# Altium schematic sheet isoJTAG-Isolation.SchDoc
size A4; Organization: UltraZohm
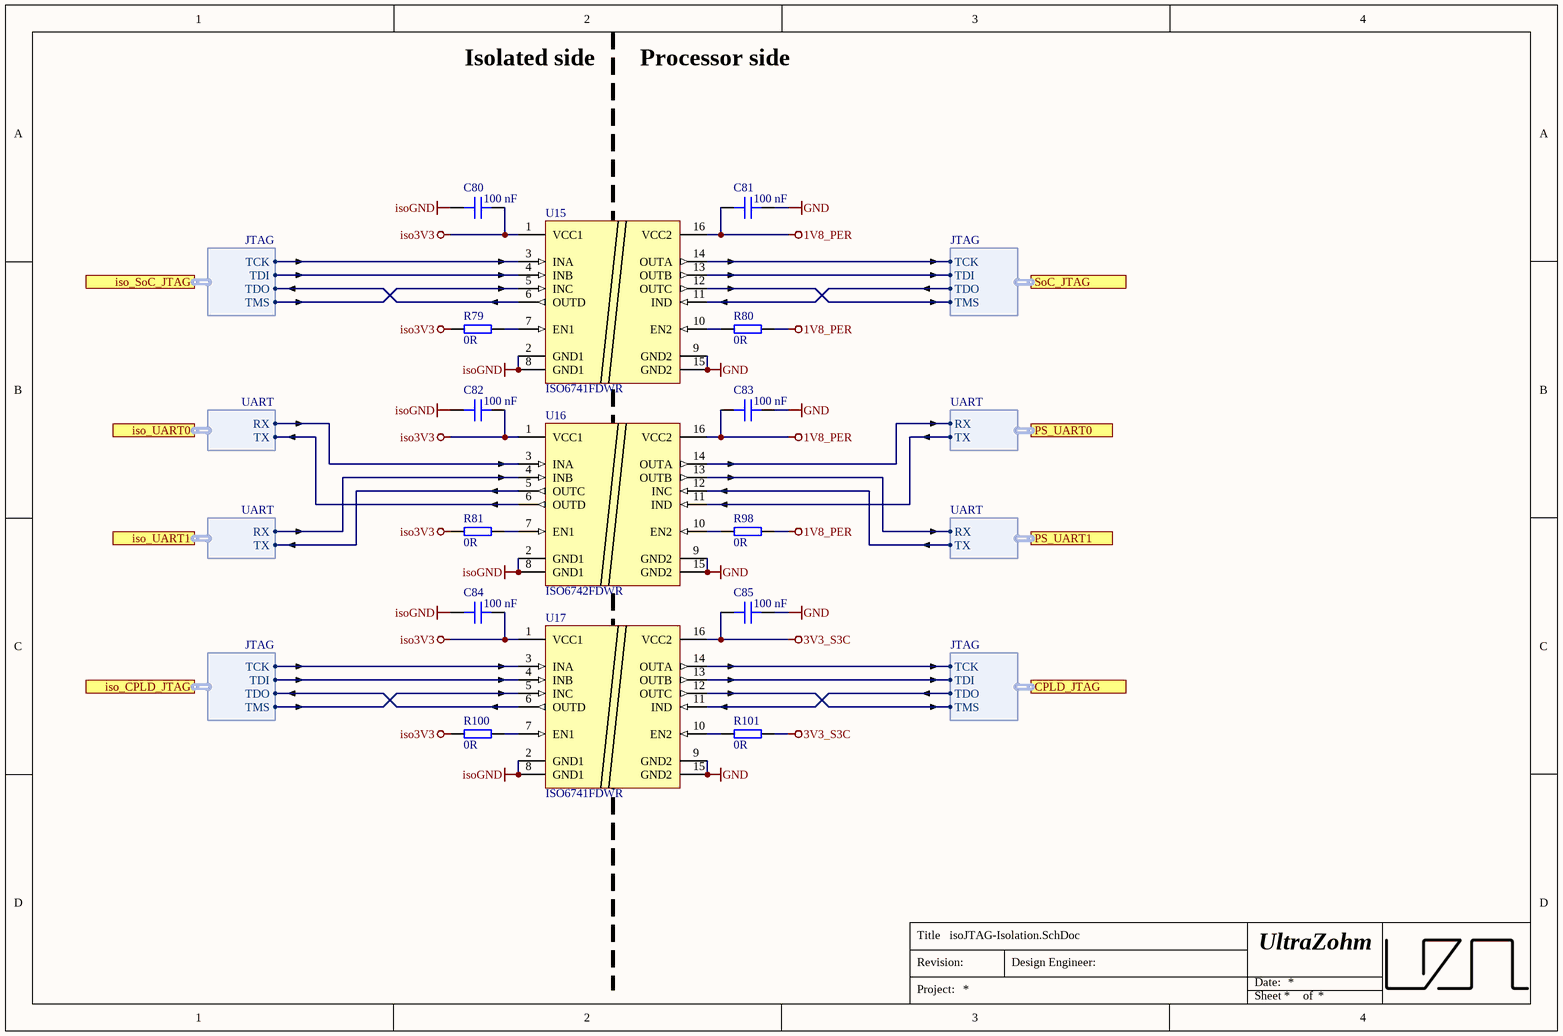
[diagram p0: isoJTAG-Isolation.SchDoc]

## Parts
C80  100 nF  [C_0402_TE]
C81  100 nF  [C_0402_TE]
C82  100 nF  [C_0402_TE]
C83  100 nF  [C_0402_TE]
C84  100 nF  [C_0402_TE]
C85  100 nF  [C_0402_TE]
R79  0R  [R_0402_TE]
R80  0R  [R_0402_TE]
R81  0R  [R_0402_TE]
R98  0R  [R_0402_TE]
R100  0R  [R_0402_TE]
R101  0R  [R_0402_TE]
U15  ISO6741FDWR  [SOIC127P1030X265-16N]
U16  ISO6742FDWR  [SOIC127P1030X265-16N]
U17  ISO6741FDWR  [SOIC127P1030X265-16N]

## Ports
CPLD_JTAG (harness JTAG), iso_CPLD_JTAG (harness JTAG), iso_SoC_JTAG (harness JTAG), iso_UART0 (harness UART), iso_UART1 (harness UART), PS_UART0 (harness UART), PS_UART1 (harness UART), SoC_JTAG (harness JTAG)

## Harnesses
JTAG: TCK, TDI, TDO, TMS
UART: RX, TX

## Nets
1V8_PER: C81.2 C83.2 R80.2 R98.2 U15.16(VCC2) U16.16(VCC2)
3V3_S3C: C85.2 R101.2 U17.16(VCC2)
GND: C81.1 C83.1 C85.1 U15.9(GND2) U15.15(GND2) U16.9(GND2) U16.15(GND2) U17.9(GND2) U17.15(GND2)
iso3V3: C80.1 C82.1 C84.1 R79.1 R81.1 R100.1 U15.1(VCC1) U16.1(VCC1) U17.1(VCC1)
isoGND: C80.2 C82.2 C84.2 U15.2(GND1) U15.8(GND1) U16.2(GND1) U16.8(GND1) U17.2(GND1) U17.8(GND1)
NetR79_2: R79.2 U15.7(EN1)
NetR80_1: R80.1 U15.10(EN2)
NetR81_2: R81.2 U16.7(EN1)
NetR98_1: R98.1 U16.10(EN2)
NetR100_2: R100.2 U17.7(EN1)
NetR101_1: R101.1 U17.10(EN2)
NetU15_3: U15.3(INA) ; port iso_SoC_JTAG.TCK
NetU15_4: U15.4(INB) ; port iso_SoC_JTAG.TDI
NetU15_5: U15.5(INC) ; port iso_SoC_JTAG.TMS
NetU15_6: U15.6(OUTD) ; port iso_SoC_JTAG.TDO
NetU15_11: U15.11(IND) ; port SoC_JTAG.TDO
NetU15_12: U15.12(OUTC) ; port SoC_JTAG.TMS
NetU15_13: U15.13(OUTB) ; port SoC_JTAG.TDI
NetU15_14: U15.14(OUTA) ; port SoC_JTAG.TCK
NetU16_3: U16.3(INA) ; port iso_UART0.RX
NetU16_4: U16.4(INB) ; port iso_UART1.RX
NetU16_5: U16.5(OUTC) ; port iso_UART1.TX
NetU16_6: U16.6(OUTD) ; port iso_UART0.TX
NetU16_11: U16.11(IND) ; port PS_UART0.TX
NetU16_12: U16.12(INC) ; port PS_UART1.TX
NetU16_13: U16.13(OUTB) ; port PS_UART1.RX
NetU16_14: U16.14(OUTA) ; port PS_UART0.RX
NetU17_3: U17.3(INA) ; port iso_CPLD_JTAG.TCK
NetU17_4: U17.4(INB) ; port iso_CPLD_JTAG.TDI
NetU17_5: U17.5(INC) ; port iso_CPLD_JTAG.TMS
NetU17_6: U17.6(OUTD) ; port iso_CPLD_JTAG.TDO
NetU17_11: U17.11(IND) ; port CPLD_JTAG.TDO
NetU17_12: U17.12(OUTC) ; port CPLD_JTAG.TMS
NetU17_13: U17.13(OUTB) ; port CPLD_JTAG.TDI
NetU17_14: U17.14(OUTA) ; port CPLD_JTAG.TCK

## Notes on the sheet
- Isolated side
- Processor side
- Title
- Revision:
- Design Engineer:
- Date:
- Project:
- Sheet
- of

## Library data of the parts
C80-C85 = GRM155R71H104KE14D: 50V 100nF X7R ±10% 0402 Multilayer Ceramic Capacitors MLCC - SMD/SMT ROHS; Manufacturer: Murata Electronics; Voltage Rating: 50 VDC; Created from: AGeiger; Manufacturer Part Number: GRM155R71H104KE14D; PartID: 144; Created On: 13.12.2023 22:03:54; ComponentLink1Description: Datasheet; ComponentLink1URL: https://datasheet.lcsc.com/lcsc/1809272047_Murata-Electronics-GRM155R71H104KE14D_C77020.pdf; Component Type: Capacitor 0402; Device Package: 0402; Last Updated: 13.12.2023 22:03:54; Mounting Type: SMD; Operating Temperature: -55 to +125°C; Series: X7R; Supplier 1: LCSC; Supplier Part Number 1: C77020; Type: Capacitor; Tolerance: 10 %; Value: 100 nF; Live Cycle Status: 1; LCSC Part Number: C77020
R79-R81 R98 R100 R101 = RC0402JR-070RL: 62.5mW Thick Film Resistors 50V 0Ω 0402 Chip Resistor - Surface Mount ROHS; Manufacturer: YAGEO; Tolerance: 1%; Created from: AGeiger; Manufacturer Part Number: RC0402JR-070RL; PartID: 310; Created On: 17.12.2023 14:16:27; ComponentLink1Description: Datasheet; ComponentLink1URL: https://datasheet.lcsc.com/lcsc/2304140030_YAGEO-RC0402JR-070RL_C60485.pdf; Component Type: SMD resistor; Device Package: 0402; Last Updated: 17.12.2023 14:16:27; Mounting Type: SMD; Supplier 1: LCSC; Supplier Part Number 1: C60485; Type: Resistor; Value: 0R; Live Cycle Status: 1; LCSC Part Number: C60485
U15 U17 = ISO6741FDWR: Digital Isolators General-purpose, quad-channel, 3/1 digital isolator 16-SOIC -40 to 125; Manufacturer: Texas Instruments; Created from: FRosner; Manufacturer Part Number: ISO6741FDWR; PartID: 6; Created On: 18/06/2024 13:06:34; ComponentLink1Description: Datasheet; ComponentLink1URL: https://www.ti.com/lit/ds/symlink/iso6741.pdf?ts=1718698076011&ref_url=https%253A%252F%252Fwww.ti.com%252Fproduct%252FISO6741; Component Type: Digital Isolator; Device Package: SOIC-16; Last Updated: 28/06/2024 13:30:42; Mounting Type: SMD; Operating Temperature: -40 to +125 °C; Series: ISO6741; Supplier 1: Mouser; Supplier Part Number 1: 595-ISO6741FDWR; Type: Digital Isolator; Value: ISO6741FDWR; LCSC Part Number: C5216433; Supplier 2: LCSC; Supplier Part Number 2: C5216433
U16 = ISO6742FDWR: Digital Isolators General-purpose, quad-channel, 2/2 digital isolator; Manufacturer: Texas Instruments; Created from: FRosner; Manufacturer Part Number: ISO6742FDWR; PartID: 5; Created On: 18/06/2024 12:17:11; ComponentLink1Description: Datasheet; ComponentLink1URL: https://www.ti.com/lit/ds/symlink/iso6742.pdf?ts=1718696457648&ref_url=https%253A%252F%252Fwww.mouser.de%252F; Component Type: Digital Isolator; Device Package: SOIC-16; Last Updated: 18/06/2024 14:14:19; Mounting Type: SMD; Operating Temperature: -40 to +125 °C; Series: ISO6742; Supplier 1: Mouser; Supplier Part Number 1: 595-ISO6742FDWR; Type: Digital Isolator; Value: ISO6742FDWR; LCSC Part Number: C5216408; Supplier 2: LCSC; Supplier Part Number 2: C5216408